# EAGLE schematic main_design2 (EAGLE 9.6.2)
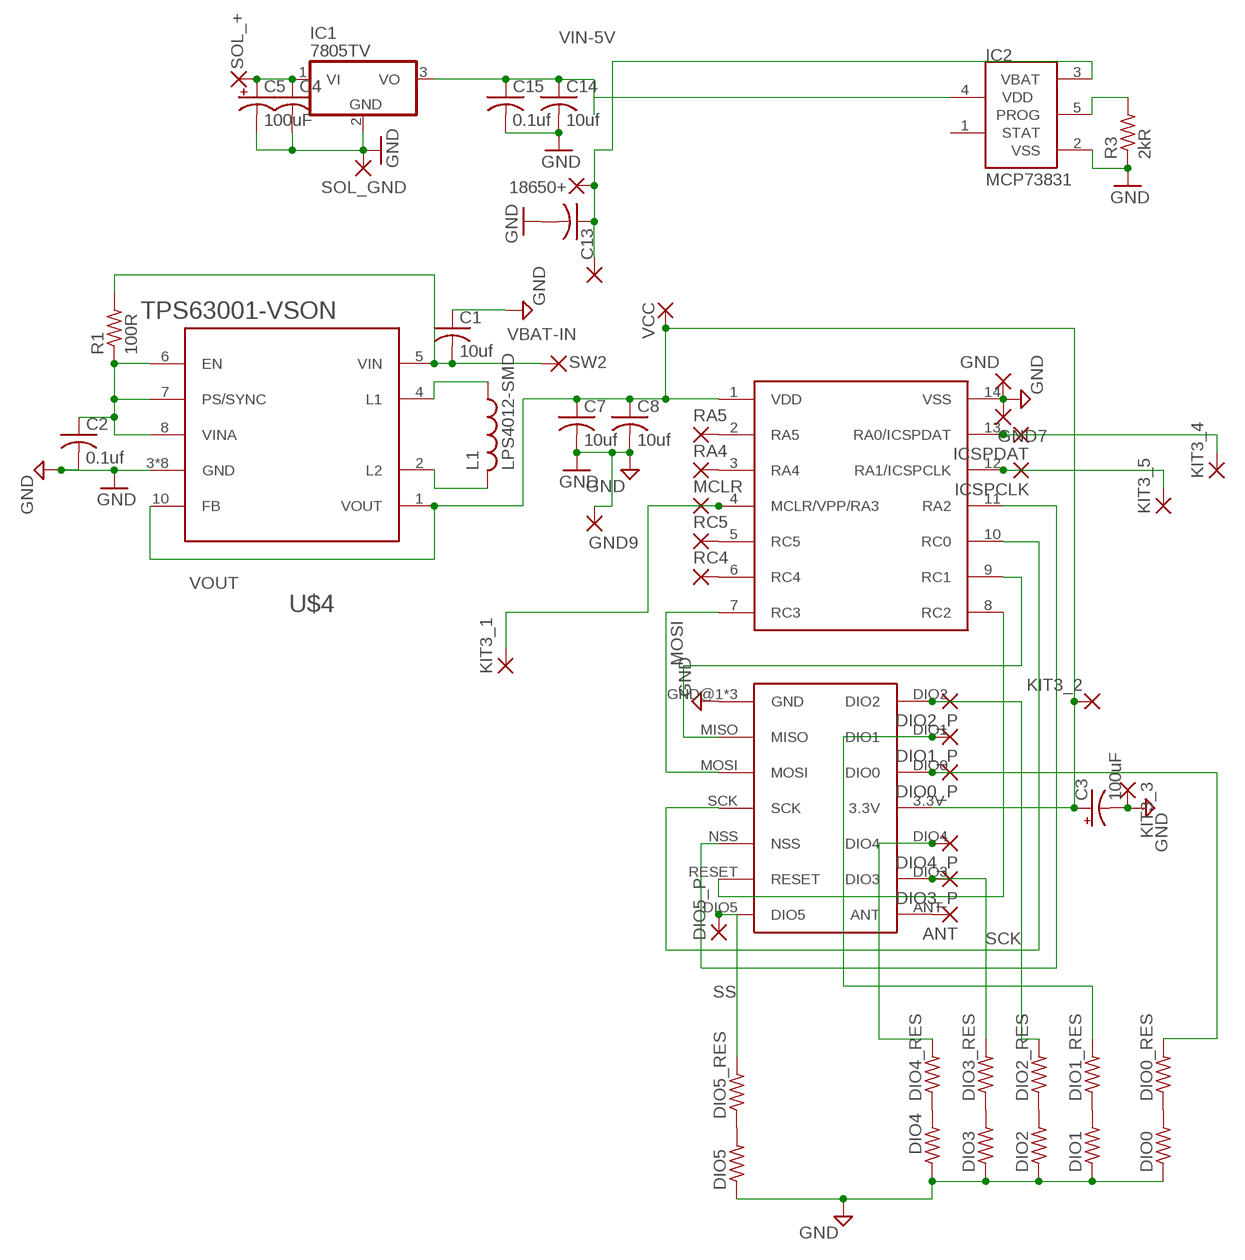
[diagram p0: schematic, sheet 1]

## Parts
18650+  1,6/0,8  [1,6/0,8]
ANT  1,6/0,8  [1,6/0,8]
C1  10uf  C-USC0805  [C0805]
C2  0.1uf  C-USC0805  [C0805]
C3  100uF  CPOL-USE5-5  [E5-5]
C4  C-USC0402  [C0402]
C5  100uF  CPOL-USE5-6  [E5-6]
C7  10uf  C-USC0805  [C0805]
C8  10uf  C-USC0805  [C0805]
C13  C-USC0805  [C0805]
C14  10uf  C-USC0805  [C0805]
C15  0.1uf  C-USC0805  [C0805]
DIO0  R-US_R0805  [R0805]
DIO0_P  1,6/0,8  [1,6/0,8]
DIO0_RES  R-US_R0805  [R0805]
DIO1  R-US_R0805  [R0805]
DIO1_P  1,6/0,8  [1,6/0,8]
DIO1_RES  R-US_R0805  [R0805]
DIO2  R-US_R0805  [R0805]
DIO2_P  1,6/0,8  [1,6/0,8]
DIO2_RES  R-US_R0805  [R0805]
DIO3  R-US_R0805  [R0805]
DIO3_P  1,6/0,8  [1,6/0,8]
DIO3_RES  R-US_R0805  [R0805]
DIO4  R-US_R0805  [R0805]
DIO4_P  1,6/0,8  [1,6/0,8]
DIO4_RES  R-US_R0805  [R0805]
DIO5  R-US_R0805  [R0805]
DIO5_P  1,6/0,8  [1,6/0,8]
DIO5_RES  R-US_R0805  [R0805]
GND  1,6/0,8  [1,6/0,8]
GND7  1,6/0,8  [1,6/0,8]
GND9  1,6/0,8  [1,6/0,8]
IC1  7805TV  [TO220V]
IC2  MCP73831  [SOT23-5L]
ICSPCLK  1,6/0,8  [1,6/0,8]
ICSPDAT  1,6/0,8  [1,6/0,8]
KIT3_1  1,6/0,8  [1,6/0,8]
KIT3_2  1,6/0,8  [1,6/0,8]
KIT3_3  1,6/0,8  [1,6/0,8]
KIT3_4  1,6/0,8  [1,6/0,8]
KIT3_5  1,6/0,8  [1,6/0,8]
L1  LPS4012-SMD  [LPS4012-222MRC]
MCLR  1,6/0,8  [1,6/0,8]
R1  100R  R-US_R0805  [R0805]
R3  2kR  R-US_0204/7  [0204/7]
RA4  1,6/0,8  [1,6/0,8]
RA5  1,6/0,8  [1,6/0,8]
RC4  1,6/0,8  [1,6/0,8]
RC5  1,6/0,8  [1,6/0,8]
SOL_+  1,6/0,8  [1,6/0,8]
SOL_GND  1,6/0,8  [1,6/0,8]
SW1  1,6/0,8  [1,6/0,8]
SW2  1,6/0,8  [1,6/0,8]
U$1  PIC16F1615-TSSOP  [PIC16F(L)1615-TSSOP]
U$3  RFM69HCW  [RFM69HCW]
U$4  TPS63001-VSON  [TPS63001-VSON]
VCC  VCC  1,6/0,8  [1,6/0,8]

## Nets
GND: C1.1 C2.2 C3.- C4.2 C5.- C7.2 C8.2 C13.2 C14.2 C15.2 DIO0.1 DIO1.1 DIO2.1 DIO3.1 DIO4.1 DIO5.1 GND7.1(P) GND9.1(P) GND.1(P) IC1.2(GND) IC2.2(VSS) KIT3_3.1(P) R3.1 SOL_GND.1(P) U$1.14(VSS) U$3.GND@1(GND) U$3.GND@2(GND) U$3.GND@3(GND) U$4.3(GND) U$4.9(GND) U$4.11@0(GND) U$4.11@1(GND) U$4.11@2(GND) U$4.11@3(GND) U$4.11@4(GND) U$4.11@5(GND)
MOSI: U$1.7(RC3) U$3.MOSI
N$1: U$1.9(RC1) U$3.MISO
N$2: C2.1 R1.1 U$4.6(EN) U$4.7(PS/SYNC) U$4.8(VINA)
N$3: RA4.1(P) U$1.3(RA4)
N$4: U$1.8(RC2) U$3.RESET
N$5: DIO1.2 DIO1_RES.1
N$6: RA5.1(P) U$1.2(RA5)
N$7: RC5.1(P) U$1.5(RC5)
N$8: RC4.1(P) U$1.6(RC4)
N$9: DIO2_P.1(P) DIO2_RES.2 U$3.DIO2
N$10: IC2.5(PROG) R3.2
N$11: DIO5.2 DIO5_RES.1
N$12: ICSPCLK.1(P) KIT3_5.1(P) U$1.12(RA1/ICSPCLK)
N$13: ICSPDAT.1(P) KIT3_4.1(P) U$1.13(RA0/ICSPDAT)
N$14: KIT3_1.1(P) MCLR.1(P) U$1.4(MCLR/VPP/RA3)
N$15: DIO1_P.1(P) DIO1_RES.2 U$3.DIO1
N$16: DIO0_P.1(P) DIO0_RES.2 U$3.DIO0
N$17: DIO4_P.1(P) DIO4_RES.2 U$3.DIO4
N$19: ANT.1(P) U$3.ANT
N$20: DIO5_P.1(P) DIO5_RES.2 U$3.DIO5
N$21: L1.P$1 U$4.4(L1)
N$22: L1.P$2 U$4.2(L2)
N$23: DIO4.2 DIO4_RES.1
N$24: DIO3.2 DIO3_RES.1
N$25: DIO0.2 DIO0_RES.1
N$26: DIO2.2 DIO2_RES.1
N$28: DIO3_P.1(P) DIO3_RES.2 U$3.DIO3
PRE-BATIN: 18650+.1(P) C13.1 IC2.3(VBAT) SW1.1(P)
SCK: U$1.10(RC0) U$3.SCK
SOL_IN: C4.1 C5.+ IC1.1(VI) SOL_+.1(P)
SS: U$1.11(RA2) U$3.NSS
VBAT-IN: C1.2 R1.2 SW2.1(P) U$4.5(VIN)
VIN-5V: C14.1 C15.1 IC1.3(VO) IC2.4(VDD)
VOUT: C3.+ C7.1 C8.1 KIT3_2.1(P) U$1.1(VDD) U$3.3.3V U$4.1(VOUT) U$4.10(FB) VCC.1(P)
Unconnected: IC2.1(STAT)

## Library data of the parts
18650+ ANT DIO0_P DIO1_P DIO2_P DIO3_P DIO4_P DIO5_P GND GND7 GND9 ICSPCLK ICSPDAT KIT3_1-KIT3_5 MCLR RA4 RA5 RC4 RC5 SOL_+ SOL_GND SW1 SW2 VCC = wirepad:1,6/0,8: THROUGH-HOLE PAD
C1 C2 C4 C7 C8 C13-C15 = rcl:C-US: CAPACITOR, American symbol; SPICEPREFIX: C
C3 C5 = rcl:CPOL-US: POLARIZED CAPACITOR, American symbol; SPICEPREFIX: C
DIO0 DIO0_RES DIO1 DIO1_RES DIO2 DIO2_RES DIO3 DIO3_RES DIO4 DIO4_RES DIO5 DIO5_RES R1 R3 = rcl:R-US_: RESISTOR, American symbol; SPICEPREFIX: R
IC1 = linear:78*: Positive VOLTAGE REGULATOR Source: http://cache.national.com/ds/LM/LM78L05.pdf http://www.fairchildsemi.com/ds/LM/LM7805.pdf
IC2 = MCP73831-SOP:MCP73831: Miniature Single-Cell, Fully Integrated Li-Ion, Li-Polymer Charge Management Controllers
L1 = LPS4012:LPS4012-SMD
U$1 = PIC16F(L)1615:PIC16F1615-TSSOP
U$3 = RFM69C:RFM69HCW
U$4 = TPS63001:TPS63001-VSON